# EAGLE design psu_2_1 (EAGLE 7.4.0)
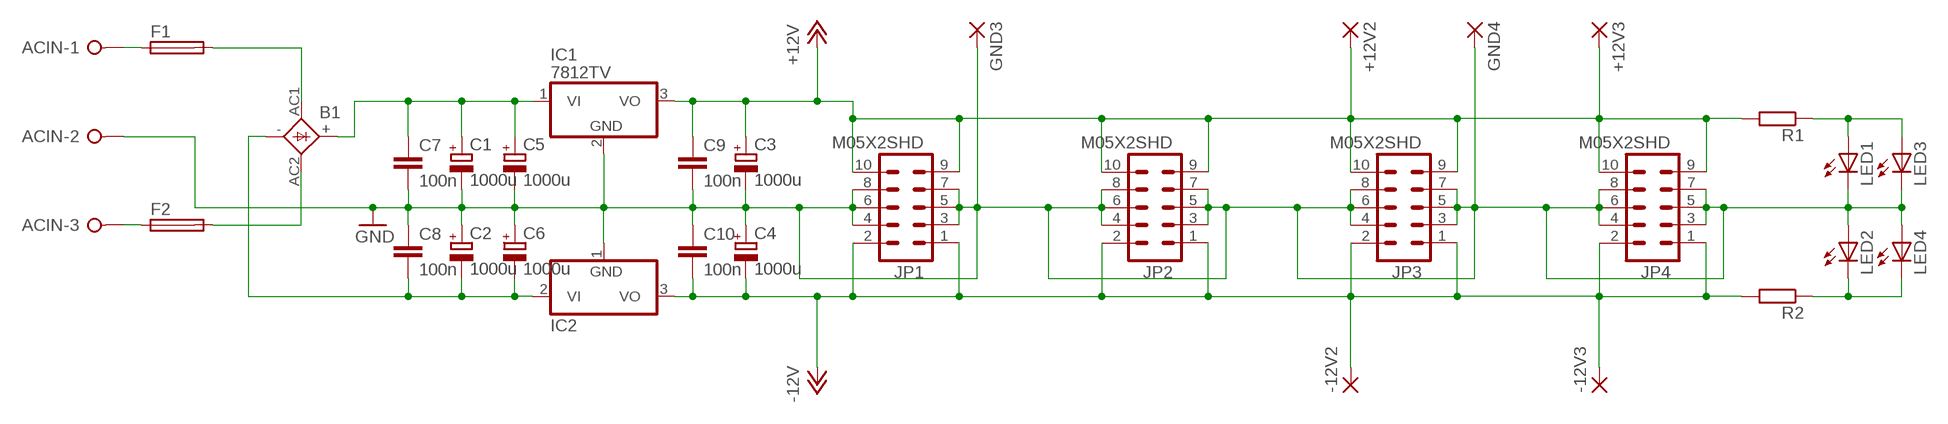
[diagram p0: schematic, sheet 1]

## Parts
+12V2  2,54/1,0  [2,54/1,0]
+12V3  2,54/1,0  [2,54/1,0]
-12V2  2,54/1,0  [2,54/1,0]
-12V3  2,54/1,0  [2,54/1,0]
ACIN  W237-3E  [W237-3E]
B1  2KBP  [2KBP]
C1  1000u  CPOL-EUE3.5-10  [E3,5-10]
C2  1000u  CPOL-EUE3.5-10  [E3,5-10]
C3  1000u  CPOL-EUE3.5-10  [E3,5-10]
C4  1000u  CPOL-EUE3.5-10  [E3,5-10]
C5  1000u  CPOL-EUE3.5-10  [E3,5-10]
C6  1000u  CPOL-EUE3.5-10  [E3,5-10]
C7  100n  C-EUC1206K  [C1206K]
C8  100n  C-EUC1206K  [C1206K]
C9  100n  C-EUC1206K  [C1206K]
C10  100n  C-EUC1206K  [C1206K]
F1  19560  [19560]
F2  19560  [19560]
GND3  2,54/1,0  [2,54/1,0]
GND4  2,54/1,0  [2,54/1,0]
IC1  7812TV  [TO220V]
IC2  7912TV  [TO220V]
JP1  M05X2SHD  [2X5-SHROUDED]
JP2  M05X2SHD  [2X5-SHROUDED]
JP3  M05X2SHD  [2X5-SHROUDED]
JP4  M05X2SHD  [2X5-SHROUDED]
LED1  LED3MM  [LED3MM]
LED2  LED3MM  [LED3MM]
LED3  LEDCHIPLED_1206  [CHIPLED_1206]
LED4  LEDCHIPLED_1206  [CHIPLED_1206]
R1  R-EU_M1206  [M1206]
R2  R-EU_M1206  [M1206]

## Nets
+12V: +12V2.1(P) +12V3.1(P) C3.+ C9.1 IC1.3(VO) JP1.9 JP1.10 JP2.9 JP2.10 JP3.9 JP3.10 JP4.9 JP4.10 R1.2
-12V: -12V2.1(P) -12V3.1(P) C4.- C10.2 IC2.3(VO) JP1.1 JP1.2 JP2.1 JP2.2 JP3.1 JP3.2 JP4.1 JP4.2 R2.2
GND: ACIN.2 C1.- C2.+ C3.- C4.+ C5.- C6.+ C7.2 C8.1 C9.2 C10.1 GND3.1(P) GND4.1(P) IC1.2(GND) IC2.1(GND) JP1.3 JP1.4 JP1.5 JP1.6 JP1.7 JP1.8 JP2.3 JP2.4 JP2.5 JP2.6 JP2.7 JP2.8 JP3.3 JP3.4 JP3.5 JP3.6 JP3.7 JP3.8 JP4.3 JP4.4 JP4.5 JP4.6 JP4.7 JP4.8 LED1.K(C) LED2.A LED3.C LED4.A
N$1: LED2.K(C) LED4.C R2.1
N$2: LED1.A LED3.A R1.1
N$3: B1.- C2.- C6.- C8.2 IC2.2(VI)
N$4: B1.+ C1.+ C5.+ C7.1 IC1.1(VI)
N$5: B1.AC1 F1.2
N$6: B1.AC2 F2.2
N$7: ACIN.1 F1.1
N$8: ACIN.3 F2.1

## Library data of the parts
+12V2 +12V3 -12V2 -12V3 GND3 GND4 = wirepad:2,54/1,0: THROUGH-HOLE PAD
ACIN = con-wago-508:W237-3E: WAGO SREW CLAMP; OC_FARNELL: unknown; OC_NEWARK: unknown
B1 = rectifier:2KBP: RECTIFIER grid 3 x 3,81 mm
C1-C6 = rcl:CPOL-EU: POLARIZED CAPACITOR, European symbol
C7-C10 = rcl:C-EU: CAPACITOR, European symbol
F1 F2 = fuse:19560: FUSE HOLDER TR5, Wickmann; MPN: 56000001009; OC_FARNELL: 1185363; OC_NEWARK: 15P8392
IC1 = cavalier:78*: Positive VOLTAGE REGULATOR Source: http://cache.national.com/ds/LM/LM78L05.pdf http://www.fairchildsemi.com/ds/LM/LM7805.pdf
IC2 = cavalier:79*: Negative VOLTAGE REGULATOR
JP1-JP4 = SparkFun:M05X2: Header 5x2 Standard 10-pin dual row 0.1" header. Commonly used with AVR-ISP. Use with Spark Fun Electronics SKU: PRT-00778
LED1-LED4 = led:LED: LED OSRAM: - CHIPLED LG R971, LG N971, LY N971, LG Q971, LY Q971, LO R971, LY R971 LH N974, LH R974 LS Q976, LO Q976, LY Q976 LO Q996 - Hyper CHIPLED LW Q18S LB Q993, LB Q99A, LB R99A - SideLED LS A670, LO A670, LY A670, LG A670, LP A670 LB A673, LV A673, LT A673, LW A673 LH A674 LY A675 LS A676, LA A676, LO A676, LY A676, LW A676 LS A679, LY A679, LG A679 - Hyper Micro SIDELED® LS Y876, LA Y876, LO Y876, LY Y876 LT Y87S - SmartLED LW L88C, LW L88S LB L89C, LB L89S, LG L890 LS L89K, LO L89K, LY L89K LS L896, LA L896, LO L896, LY L896 - TOPLED LS T670, LO T670, LY T670, LG T670, LP T670 LSG T670, LSP T670, LSY T670, LOP T670, LYG T670 LG T671, LOG T671, LSG T671 LB T673, LV T673, LT T673, LW T673 LH T674 LS T676, LA T676, LO T676, LY T676, LB T676, LH T676, LSB T676, LW T676 LB T67C, LV T67C, LT T67C, LS T67K, LO T67K, LY T67K, LW E67C LS E67B, LA E67B, LO E67B, LY E67B, LB E67C, LV E67C, LT E67C LW T67C LS T679, LY T679, LG T679 LS T770, LO T770, LY T770, LG T770, LP T770 LB T773, LV T773, LT T773, LW T773 LH T774 LS E675, LA E675, LY E675, LS T675 LS T776, LA T776, LO T776, LY T776, LB T776 LHGB T686 LT T68C, LB T68C - Hyper Mini TOPLED® LB M676 - Mini TOPLED Santana® LG M470 LS M47K, LO M47K, LY M47K Source: http://www.osram.convergy.de LUXEON: - LUMILED® LXK2-PW12-R00, LXK2-PW12-S00, LXK2-PW14-U00, LXK2-PW14-V00 LXK2-PM12-R00, LXK2-PM12-S00, LXK2-PM14-U00 LXK2-PE12-Q00, LXK2-PE12-R00, LXK2-PE12-S00, LXK2-PE14-T00, LXK2-PE14-U00 LXK2-PB12-K00, LXK2-PB12-L00, LXK2-PB12-M00, LXK2-PB14-N00, LXK2-PB14-P00, LXK2-PB14-Q00 LXK2-PR12-L00, LXK2-PR12-M00, LXK2-PR14-Q00, LXK2-PR14-R00 LXK2-PD12-Q00, LXK2-PD12-R00, LXK2-PD12-S00 LXK2-PH12-R00, LXK2-PH12-S00 LXK2-PL12-P00, LXK2-PL12-Q00, LXK2-PL12-R00 Source: www.luxeon.com KINGBRIGHT: KA-3528ASYC Source: www.kingbright.com
R1 R2 = rcl:R-EU_: RESISTOR, European symbol

## Board
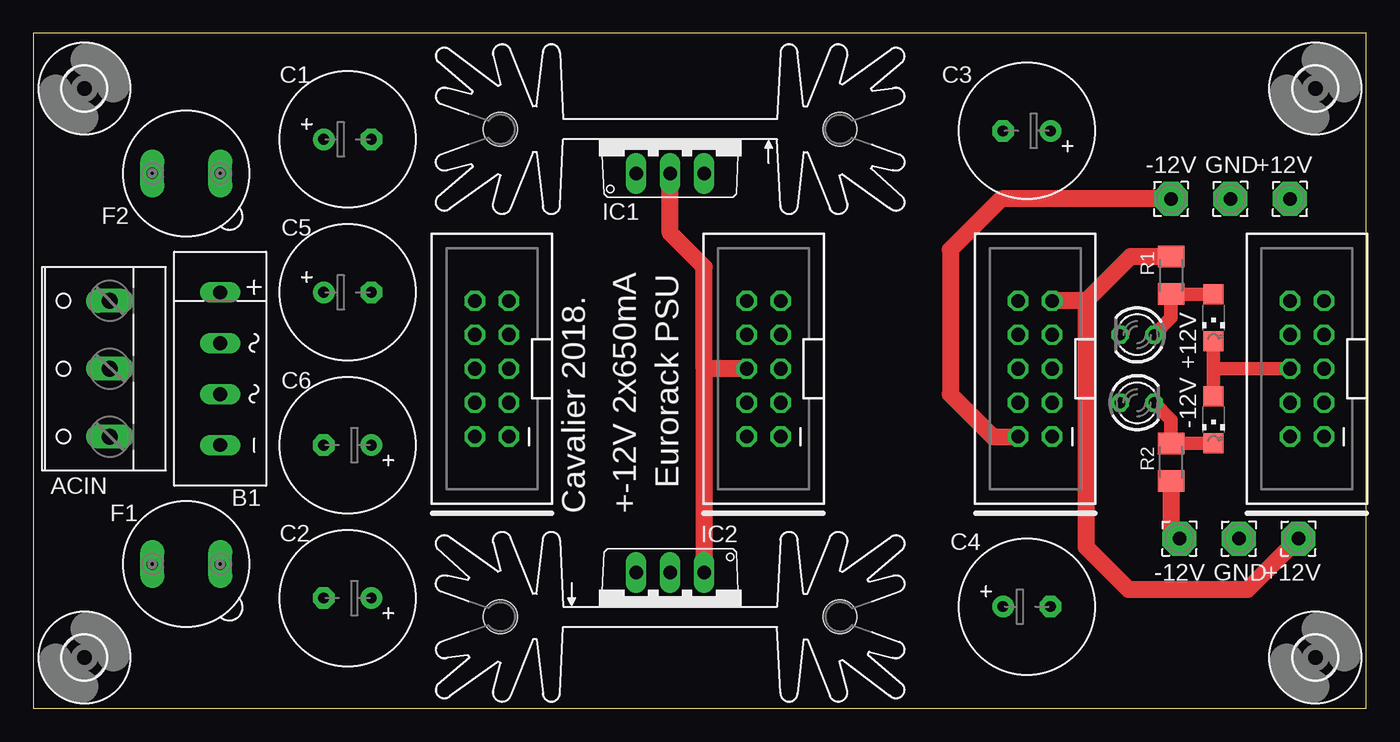
[diagram p1: board, top side]
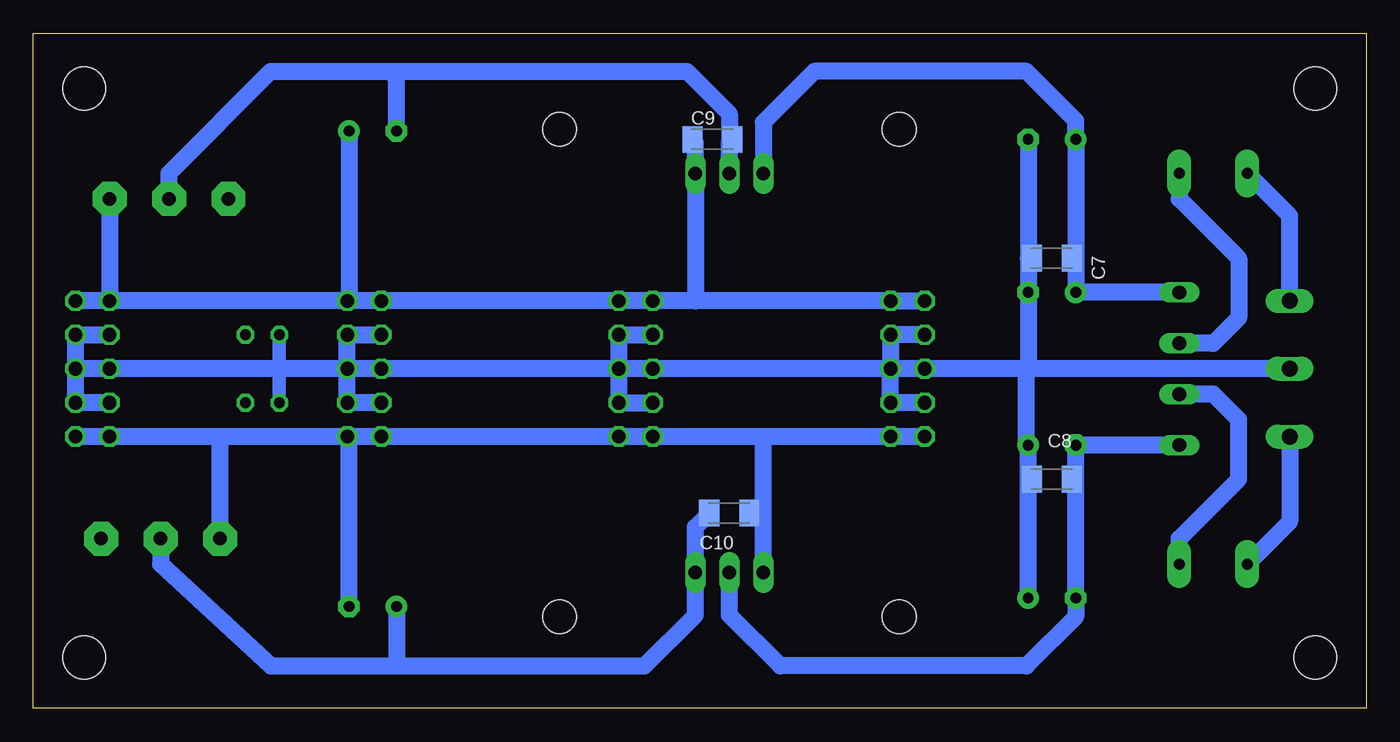
[diagram p2: board, bottom side, seen from below]

Size 99.67 x 50.47 mm. Coordinates in mm from the lower left corner, seen from the top.
Outline: 0,0 99.67,0 99.67,50.47 0,50.47 0,0
Copper layers (1*16): Top 0.035mm / dielectric 1.5mm / Bottom 0.035mm
Design rules "default": minimum track width 10mil, minimum drill 24mil, track to track 8mil, track to pad 8mil, pad to pad 8mil, via to via 8mil, smd to smd 8mil, copper to edge 40mil, drill to drill 8mil, minimum pad ring 10mil, minimum via ring 8mil, stop-mask expansion 4mil, vias tented up to drill 0mil, thermal gap 10mil

### Footprints (pad centres in the part's own frame; a part is rotated, then mirrored left to right if it is on the bottom)
2,54/1,0 = drill 1.016 pad 2.54 octagon: 1 0,0
W237-3E = drill 1.194 long: 1 -5.08,-0.635; 2 0,-0.635; 3 5.08,-0.635
2KBP = drill 1.016 long: + 5.715,0; - -5.715,0; AC1 -1.905,0; AC2 1.905,0
E3,5-10 = drill 0.813 pad 1.6: + -1.778,0 | drill 0.813 pad 1.6 octagon: - 1.778,0
C1206K = smd 1.5 x 2: 1 -1.5,0; 2 1.5,0
19560 = drill 0.813 pad 1.778 long: 1 -2.54,0; 2 2.54,0
TO220V = drill 1.016 long: 1 -2.54,-2.54; 2 0,-2.54; 3 2.54,-2.54
2X5-SHROUDED = drill 1.016 octagon: 1 -1.27,5.08; 2 1.27,5.08; 3 -1.27,2.54; 4 1.27,2.54; 5 -1.27,0; 6 1.27,0; 7 -1.27,-2.54; 8 1.27,-2.54; 9 -1.27,-5.08; 10 1.27,-5.08
LED3MM = drill 0.813 octagon: A -1.27,0; K 1.27,0
CHIPLED_1206 = smd 1.5 x 1.5: A 0,-1.75; C 0,1.75
M1206 = smd 1.6 x 2: 1 -1.4,0; 2 1.4,0
3,2 = hole 3.2: 0,0
SK104 = hole 2.54: -12.7,-0.762; 12.7,-0.762

### Placement (x,y rotation side)
+12V2  93.98,38.1 0 top
+12V3  94.61,12.7 0 top
-12V2  85.09,38.1 0 top
-12V3  85.72,12.7 0 top
ACIN  5.08,25.4 90 top
B1  13.97,25.4 90 top
C1  23.5,42.55 0 top
C2  23.5,8.26 180 top
C3  74.3,43.18 180 top
C4  74.3,7.62 0 top
C5  23.5,31.11 0 top
C6  23.5,19.68 180 top
C7  23.5,33.66 180 bottom
C8  23.5,17.14 0 bottom
C9  48.9,42.55 0 bottom
C10  47.62,14.61 0 bottom
F1  11.43,10.79 0 top
F2  11.43,40.01 0 top
GND3  90.17,12.7 0 top
GND4  89.53,38.1 0 top
IC1  47.62,42.55 0 top
IC2  47.62,7.62 180 top
JP1  34.29,25.4 180 top
JP2  54.61,25.4 180 top
JP3  74.93,25.4 180 top
JP4  95.25,25.4 180 top
LED1  82.55,27.94 180 top
LED2  82.55,22.86 0 top
LED3  88.27,29.21 180 top
LED4  88.27,21.59 180 top
R1  85.09,32.38 90 top
R2  85.09,18.41 270 top
U$1  [3,2]  3.81,3.81 0 top
U$2  [3,2]  95.89,3.81 0 top
U$3  [3,2]  3.81,46.35 0 top
U$4  [3,2]  95.89,46.35 0 top
U$5  [SK104]  47.62,42.55 180 top
U$7  [SK104]  47.62,7.62 0 top

### Tracks (layer width: path | path; a pad name or v marks a point on that pad's centre or on a via)
+12V
  Top 1.27: +12V3.1 90.81,8.89 81.92,8.89 78.74,12.06 78.74,30.48 | 78.74,30.48 JP3.9 | R1.2 82.05,33.78 78.74,30.48
  Bottom 1.27: JP1.10 JP1.9 50.16,30.48 | 50.16,30.48 JP2.10 JP2.9 JP3.10 JP3.9 | JP3.9 JP4.10 | JP4.10 JP4.9 | C9.1 50.16,42.31 IC1.3 50.16,30.48 | C3.+ 76.07,30.61 JP3.9 | +12V2.1 JP4.10
-12V
  Top 1.27: -12V2.1 72.39,38.1 68.58,34.29 68.58,23.5 71.75,20.32 JP3.2 | R2.2 85.09,13.34 -12V3.1
  Bottom 1.27: JP1.2 JP1.1 45.09,20.32 | 45.09,20.32 JP2.2 JP2.1 JP3.2 JP3.1 | JP3.1 85.72,20.32 | 85.72,20.32 JP4.2 JP4.1 | IC2.3 45.09,14.61 | 45.09,14.61 45.09,20.32 | C10.2 45.09,14.61 | C4.- 76.07,20.19 JP3.1 | -12V3.1 85.72,20.32
GND
  Top 1.016: 88.27,25.4 JP4.6 | LED3.C 88.27,25.4 | LED4.A 88.27,25.4
  Top 1.27: JP2.6 50.16,25.4 | 50.16,25.4 IC2.1 | 50.16,25.4 50.16,33.02 47.62,35.56 IC1.2
  Bottom 1.016: LED1.K 81.28,25.4 LED2.A
  Bottom 1.27: JP1.5 JP1.6 25.4,25.4 | JP1.4 JP1.3 JP1.5 | JP1.8 JP1.7 JP1.5 | JP2.4 JP2.3 JP2.5 | JP2.8 JP2.7 JP2.5 | JP2.5 JP3.6 JP3.5 | JP2.5 JP2.6 JP1.5 | JP3.4 JP3.3 JP3.5 | JP3.5 JP3.7 JP3.8 | JP3.5 81.28,25.4 JP4.6 JP4.5 | JP4.4 JP4.3 JP4.5 | JP4.5 JP4.7 JP4.8 | ACIN.2 25.4,25.4 | C2.+ 25.27,17.14 | 25.27,17.14 C6.+ 25.4,19.68 25.4,25.4 | C8.1 25.27,17.14 | C1.- 25.27,33.66 | 25.27,33.66 C5.- 25.27,25.53 25.4,25.4 | C7.2 25.27,33.66 | C10.1 50.16,13.56 IC2.1 50.16,6.99 53.98,3.17 72.39,3.17 | IC1.2 47.62,42.31 | 47.62,42.31 C9.2 | GND3.1 90.17,10.79 81.92,3.17 72.39,3.17 | C4.+ 72.52,3.3 72.39,3.17 | GND4.1 89.53,40.01 81.92,47.62 73.03,47.62 | 73.03,47.62 50.8,47.62 47.62,44.45 47.62,42.31 | C3.- 72.52,47.12 73.03,47.62
N$1
  Top 1.016: LED4.C 85.7,19.84 85.06,19.82 R2.1 85.09,21.59 LED2.K
N$2
  Top 1.016: LED1.A 85.09,29.21 R1.1 88.24,30.98 LED3.A
N$3
  Bottom 1.27: B1.- C6.- 21.72,17.78 | 21.72,17.78 C2.- 21.72,6.86 25.4,3.17 43.81,3.17 47.62,6.99 IC2.2 | C8.2 22,17.5 21.72,17.78
N$4
  Bottom 1.27: B1.+ C5.+ 21.72,33.66 | 21.72,33.66 C1.+ 21.72,43.94 25.4,47.62 41.27,47.62 45.09,43.81 IC1.1 | C7.1 21.72,33.66
N$5
  Bottom 1.27: F1.2 13.97,12.7 9.53,17.14 9.53,21.59 11.43,23.5 B1.AC1
N$6
  Bottom 1.27: F2.2 13.97,38.1 9.53,33.66 9.53,29.21 11.43,27.3 B1.AC2
N$7
  Bottom 1.27: ACIN.1 5.71,13.97 F1.1
N$8
  Bottom 1.27: ACIN.3 5.71,36.83 F2.1

### Text on the board
tPlace: -12V | GND | +12V | +12V | -12V | Eurorack PSU | Cavalier 2018. | +-12V 2x650mA | -12V | GND | +12V